# Altium project HeadTracker.PrjPcb
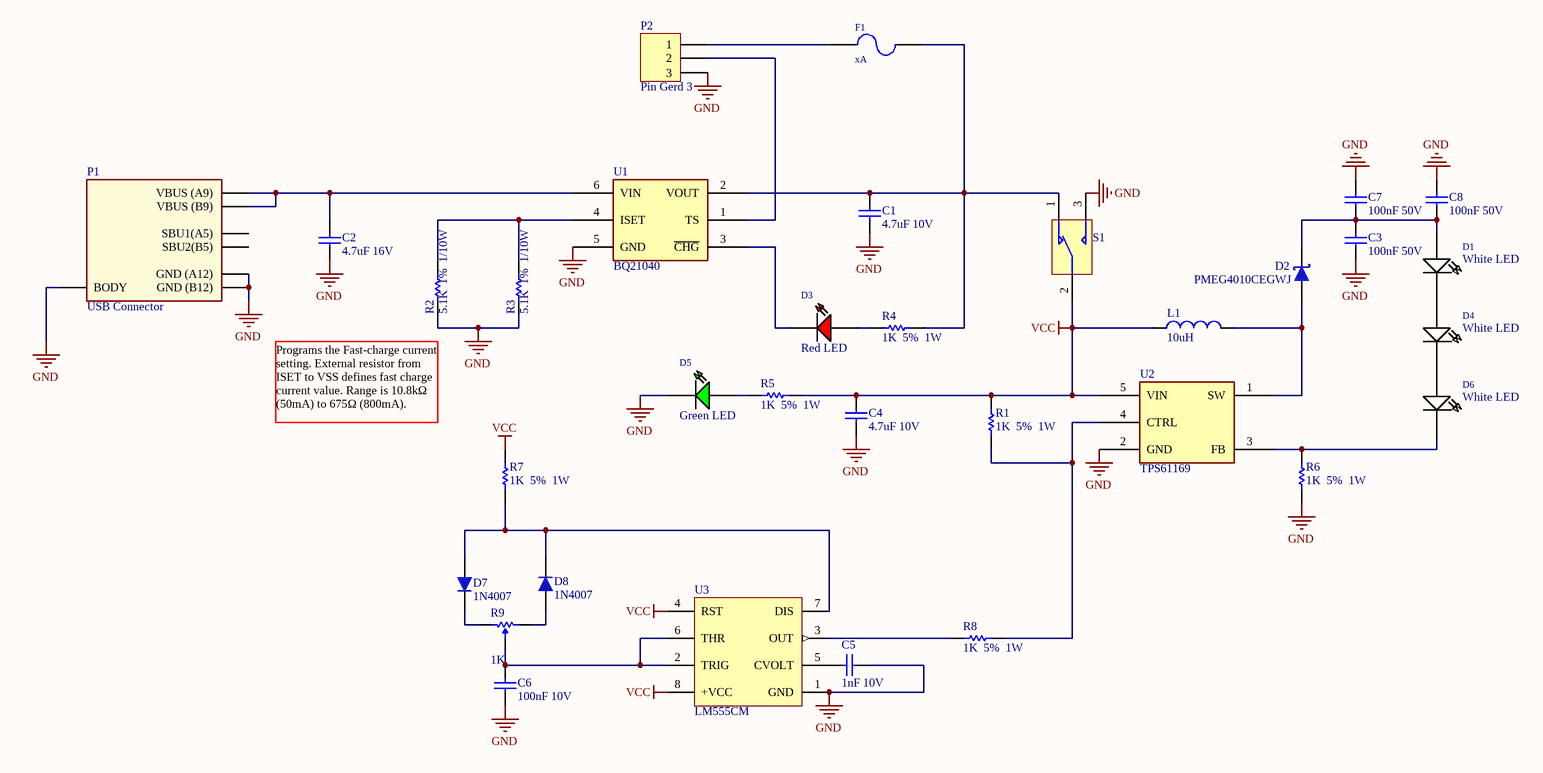
[diagram p0: HeadTracker.SchDoc]
1 sheet, 33 parts. Net scope: global (net labels, ports and power ports of the same name join across sheets).
Board file: HeadTracker.PcbDoc

## Sheet HeadTracker.SchDoc: Head Tracker
size B; ApprovedBy: Milad Mansouri; CheckedBy: Milad Mansouri; Author: Milad Mansouri; DrawnBy: Milad Mansouri; Engineer: Milad Mansouri; DocumentNumber: 1; Revision: 1.0; SheetNumber: 1; SheetTotal: 1

### Parts
C1  4.7uF 10V  [CAP0805]
C2  4.7uF 16V  [CAP0805]
C3  100nF 50V  [CAP0805]
C4  4.7uF 10V  [CAP0805]
C5  1nF 10V  [CAP0805]
C6  100nF 10V  [CAP0805]
C7  100nF 50V  [CAP0805]
C8  100nF 50V  [CAP0805]
D1  White LED  [LED_5mm - Right2]
D2  PMEG4010CEGWJ  [DO-214-AC (SMA)]
D3  Red LED  [LED_0805]
D4  White LED  [LED_5mm - Right2]
D5  Green LED  [LED_0805]
D6  White LED  [LED_5mm - Right2]
D7  1N4007  [DO-214-AA (SMB)]
D8  1N4007  [DO-214-AA (SMB)]
F1  xA  [Fuse_0805]
L1  10uH  [CDRH74]
P1  USB Connector  [USB TYPE-C 6P(073)]
P2  Pin Gerd 3  [Pin Gerd S 3]
R1  1K  5%  1W  [RES0805]
R2  5.1K  1%  1/10W  [RES0805]
R3  5.1K  1%  1/10W  [RES0805]
R4  1K  5%  1W  [RES0805]
R5  1K  5%  1W  [RES0805]
R6  1K  5%  1W  [RES0805]
R7  1K  5%  1W  [RES0805]
R8  1K  5%  1W  [RES0805]
R9  1K  [POT 1]
S1  (Switch) SPDT_Subminiator  [SPDT Subminiator]  (value not drawn)
U1  BQ21040  [SOT23-6]
U2  TPS61169  [SOT23-5]
U3  LM555CM  [SOIC 8-3.9mm]

### Nets
GND: C1.1 C2.1 C3.1 C4.1 C5.1 C6.1 C7.2 C8.2 D5.2(K) P1.0(BODY) P1.A12(GND_(A12)) P1.B12(GND_(B12)) P2.3 R2.1 R3.1 R6.1 S1.3 U1.5(GND) U2.2(GND) U3.1(GND)
VCC: C4.2 L1.1 R1.2 R5.2 R7.2 S1.2 U2.5(VIN) U3.4(RST) U3.8(+VCC)
NetC1_2: C1.2 F1.1 R4.2 S1.1 U1.2(VOUT)
NetC2_2: C2.2 P1.A9(VBUS_(A9)) P1.B9(VBUS_(B9)) U1.6(VIN)
NetC3_2: C3.2 C7.1 C8.1 D1.1(A) D2.2(K)
NetC5_2: C5.2 U3.5(CVOLT)
NetC6_2: C6.2 R9.3 U3.2(TRIG) U3.6(THR)
NetD1_2: D1.2(K) D4.1(A)
NetD2_1: D2.1(A) L1.2 U2.1(SW)
NetD3_1: D3.1(A) R4.1
NetD3_2: D3.2(K) U1.3(~{C}~{H}~{G})
NetD4_2: D4.2(K) D6.1(A)
NetD5_1: D5.1(A) R5.1
NetD6_2: D6.2(K) R6.2 U2.3(FB)
NetD7_1: D7.1(A) D8.2(K) R7.1 U3.7(DIS)
NetD7_2: D7.2(K) R9.2
NetD8_1: D8.1(A) R9.1
NetF1_2: F1.2 P2.1
NetP2_2: P2.2 U1.1(TS)
NetR1_1: R1.1 R8.1 U2.4(CTRL)
NetR2_2: R2.2 R3.2 U1.4(ISET)
NetR8_2: R8.2 U3.3(OUT)

Not connected (* = marked no-connect by the designer): P1 A5(SBU1(A5)) B5(SBU2(B5))

### Notes on the sheet
- (near R2) Programs the Fast-charge current setting. External resistor from ISET to VSS defines fast charge current value. Range is 10.8kΩ (50mA) to 675Ω (800mA).

### Library data of the parts
C1 C4 = Capacitor Ceramic - SMD: Multilayer Ceramic Capacitors MLCC - SMD/SMT; Specification: Multilayer Ceramic Capacitors MLCC - SMD/SMT 4.7uF  X7R 10%  10V; Tolerance: X7R 10%; Temperature Range: -55°C ~ 125 °C; Value: 4.7uF; Voltage_Rating: 10V
C2 = Capacitor Ceramic - SMD: Multilayer Ceramic Capacitors MLCC - SMD/SMT; Specification: Multilayer Ceramic Capacitors MLCC - SMD/SMT 4.7uF  X7R 10%  16V; Tolerance: X7R 10%; Temperature Range: -55°C ~ 125 °C; Value: 4.7uF; Voltage_Rating: 16V
C3 C7 C8 = Capacitor Ceramic - SMD: Multilayer Ceramic Capacitors MLCC - SMD/SMT; Specification: Multilayer Ceramic Capacitors MLCC - SMD/SMT 100nF  X7R 10%  50V; Tolerance: X7R 10%; Temperature Range: -55°C ~ 125 °C; Value: 100nF; Voltage_Rating: 50V
C5 = Capacitor Ceramic - SMD: Multilayer Ceramic Capacitors MLCC - SMD/SMT; Specification: Multilayer Ceramic Capacitors MLCC - SMD/SMT 1nF  X7R 10%  10V; Tolerance: X7R 10%; Temperature Range: -55°C ~ 125 °C; Value: 1nF; Voltage_Rating: 10V
C6 = Capacitor Ceramic - SMD: Multilayer Ceramic Capacitors MLCC - SMD/SMT; Specification: Multilayer Ceramic Capacitors MLCC - SMD/SMT 100nF  X7R 10%  10V; Tolerance: X7R 10%; Temperature Range: -55°C ~ 125 °C; Value: 100nF; Voltage_Rating: 10V
D1 D4 D6 = LED White: Typical LED; Pacakge: 3528 SMD; Specification: White LED; Temperature Range: -40°C to 150°C
D2 = Diode Schottky: Schottky Rectifiers; Temperature Range: -x°C to x°C; PartNumber: PMEG4010CEGWJ
D3 = LED Red: Typical LED; Pacakge: 3528 SMD; Specification: Red LED; Temperature Range: -40°C to 150°C
D5 = LED Green: Typical LED; Pacakge: 3528 SMD; Specification: Green LED; Temperature Range: -40°C to 150°C
D7 D8 = Diode: Generic Diode; Temperature Range: -x°C to x°C; PartNumber: 1N4007
F1 = Fuse: Fuses 5x20 with holdeer pins; Tolerance: ?%; Pacakge: 0603; Specification: -; Temperature Range: -40°C to 150°C; Value: xA
L1 = Inductor: Tolerance: ?%; Pacakge: 0603; Specification: -; Temperature Range: -40°C to 150°C; Value: 10uH
P1 = USB C 6P: USB Connector Type A; Designer: ABBAS BASEREH; Max Current: 600mA; Mounting Technology: Surface Mount\Through-Hole; Category: Connector; Pin Count: 4-6; Publisher: ABBAS BASEREH; Status: Unreleased; ComponentLink1Description: Datasheet; ComponentLink2Description: Reference; Update: 1395-11-17
P2 = Pin Gerd 3: Stright; VALUE: Pin Gerd 3
R1 R4-R8 = Resistor Thick Film - SMD: Thick Film Resistor SMD; Specification: Tick Film Resistor 1K 5% 1W; Tolerance: 5%; Temperature Range: -55°C ~ 155 °C; Value: 1K; Power: 1W; Type: Thick Film
R2 R3 = Resistor Thick Film - SMD: Thick Film Resistor SMD; Specification: Tick Film Resistor 5.1K 1% 1/10W; Tolerance: 1%; Temperature Range: -55°C ~ 155 °C; Value: 5.1K; Power: 1/10W; Type: Thick Film
R9 = Potentiometer: Tolerance: ?%; Pacakge: 0603; Specification: -; Temperature Range: -40°C to 150°C; Value: 1K
S1 = (Switch) SPDT_Subminiator: Subminiator SPDT Switch; Company: E.P.I.L; Design date: 2011/11/02
U1 = BQ21040: bq21040 0.8-A, Single-Input, Single Cell Li-Ion and Li-Pol Battery Charger; SMD Code: 130E; Temperature Range: -40°C to 125°C; Package: SOT23-6; Specification: BQ21040 0.8-A, Single-Input, Single Cell Li-Ion and Li-Pol Battery Charger; PartNumber: BQ21040
U2 = TPS61169: TPS61169 38V High Current-Boost WLED Driver With PWM Control; SMD Code: SZL; Temperature Range: -40°C to 85°C; Package: SOT23-5; Specification: TPS61169 38V High Current-Boost WLED Driver With PWM Control; PartNumber: TPS61169
U3 = LM555CM: Timer, 8-pin Narrow SOIC; PartNumber: LM555CM; Temperature Range: -x°C to x°C